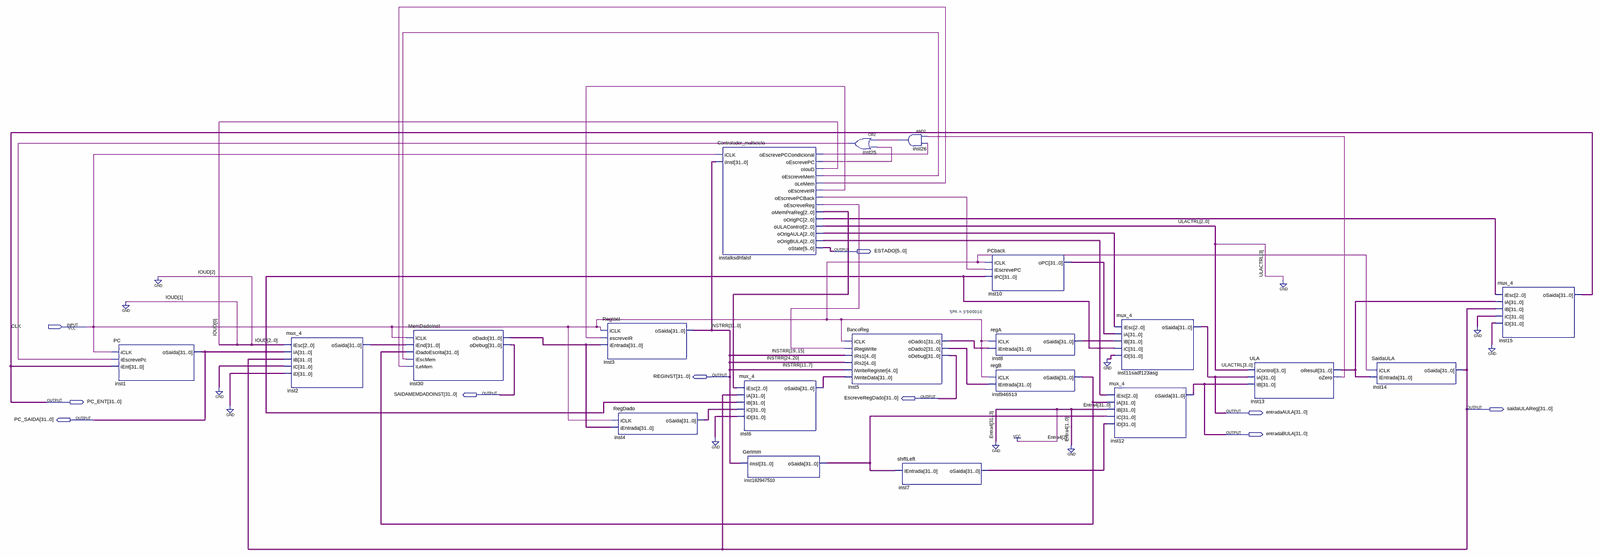
[diagram p0: schematic sheet, whole]
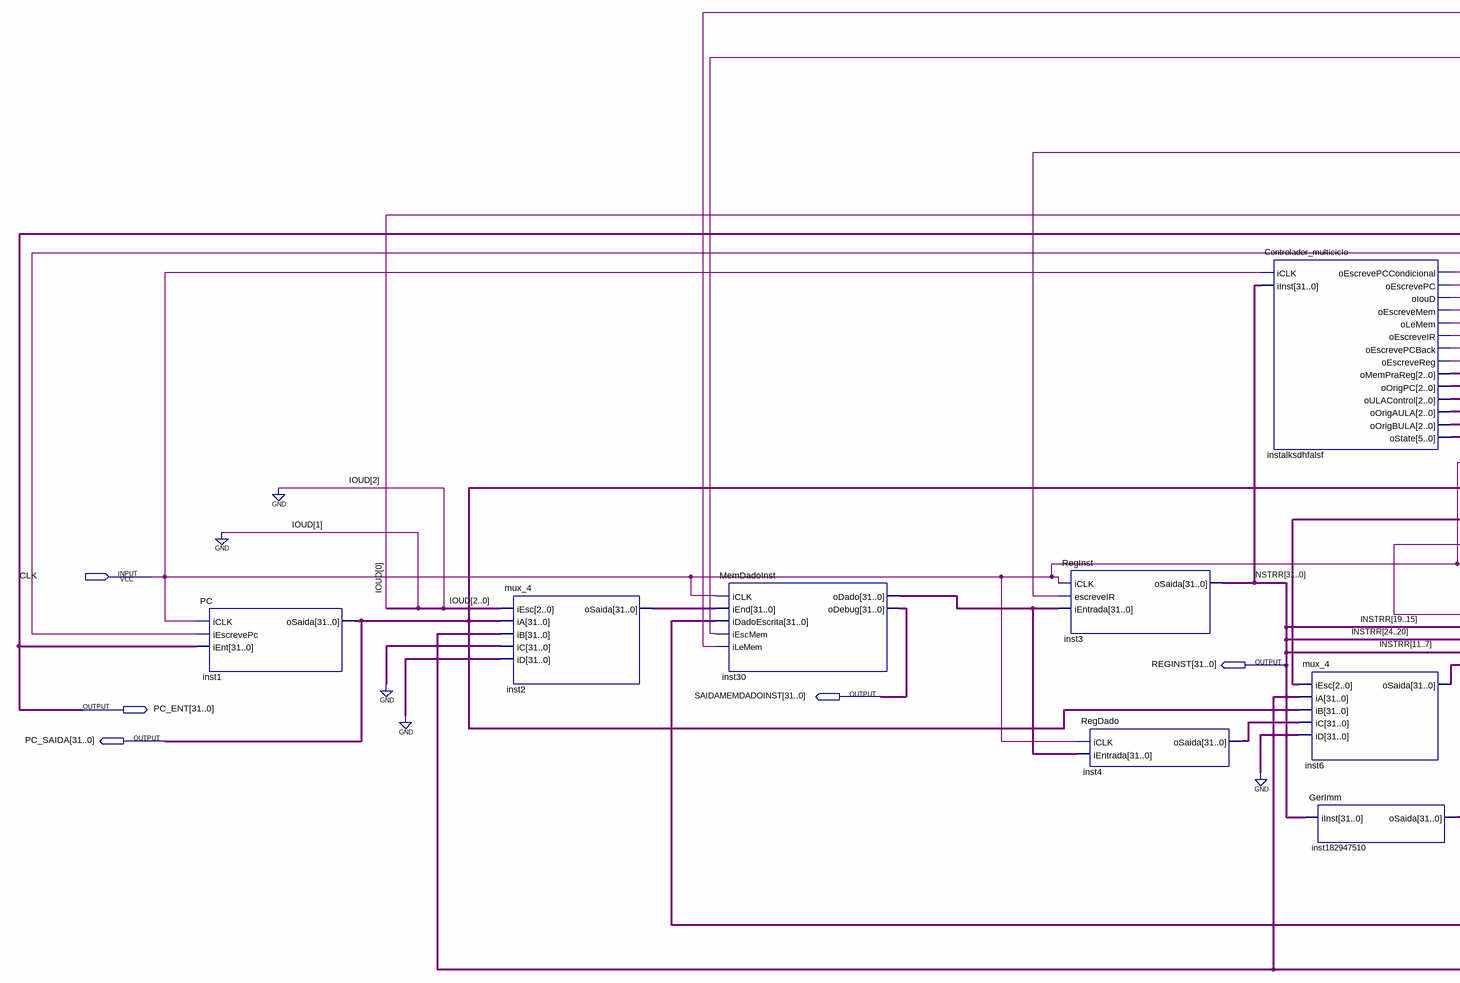
[diagram p1: schematic sheet, left part]
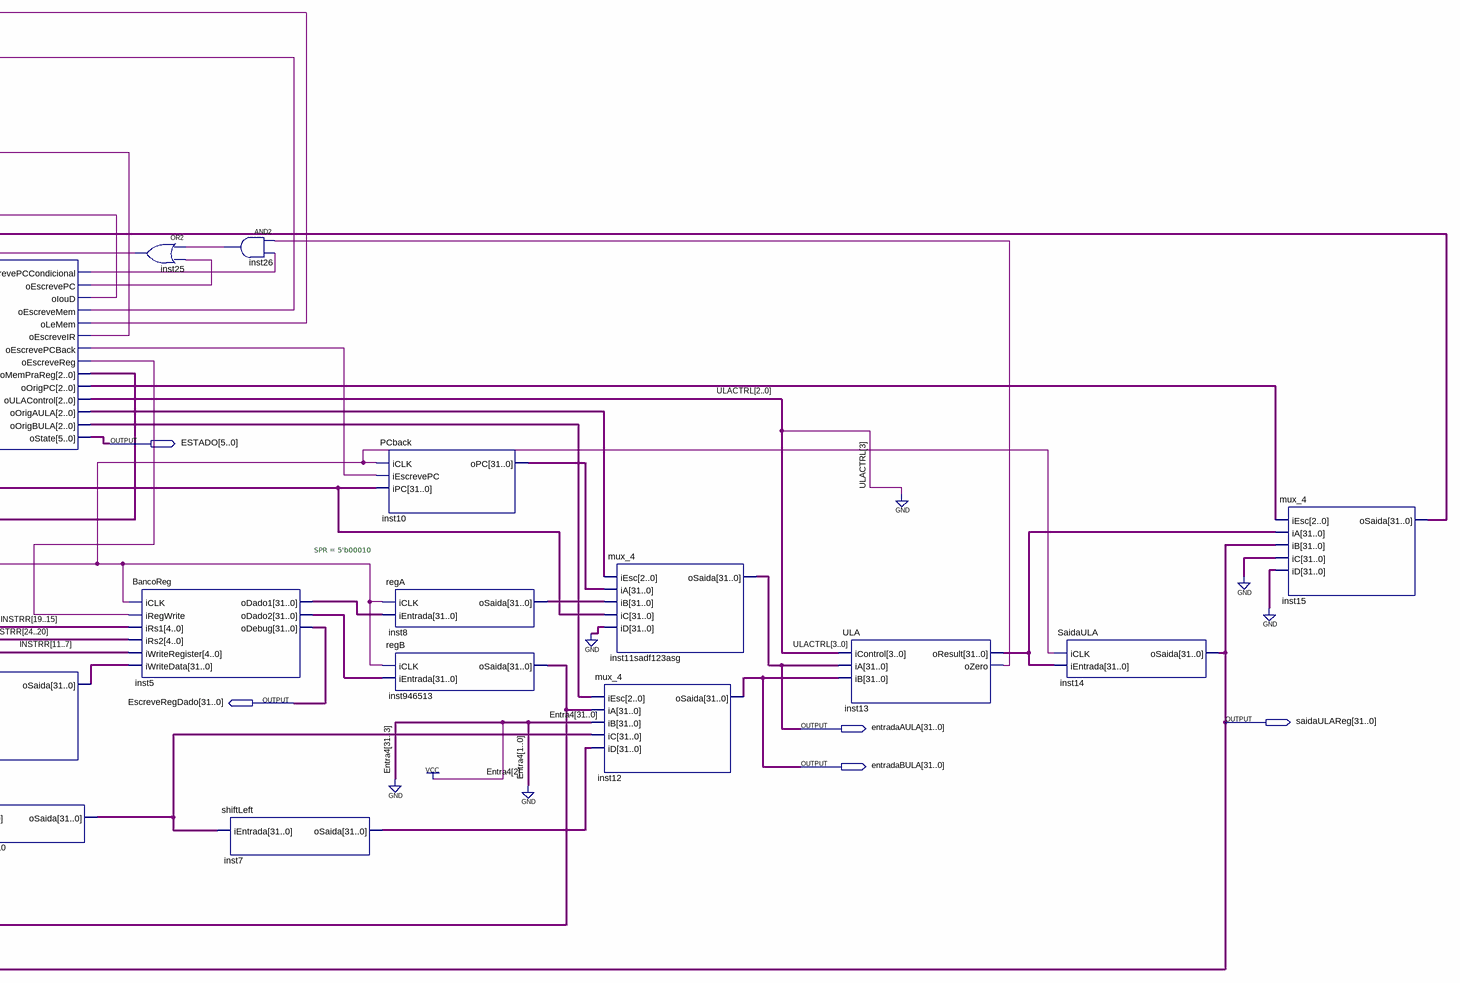
[diagram p2: schematic sheet, right part]
// Quartus schematic multiciclo.bdf as structural Verilog: 20 symbols, 10 pins
module multiciclo (
  input  CLK,
  output [5:0] ESTADO,
  output [31:0] REGINST,
  output [31:0] SAIDAMEMDADOINST,
  output [31:0] EscreveRegDado,
  output [31:0] PC_ENT,
  output [31:0] saidaULAReg,
  output [31:0] entradaAULA,
  output [31:0] PC_SAIDA,
  output [31:0] entradaBULA
);

  wire inst13_ozero, inst25_out, inst26_out, instalksdhfalsf_oescreveir, instalksdhfalsf_oescrevemem,
       instalksdhfalsf_oescrevepc, instalksdhfalsf_oescrevepcback, instalksdhfalsf_oescrevepccondicional,
       instalksdhfalsf_oescrevereg, instalksdhfalsf_olemem;
  wire [0:0] IOUD;
  wire [2:0] instalksdhfalsf_omemprareg, instalksdhfalsf_oorigaula, instalksdhfalsf_oorigbula,
       instalksdhfalsf_oorigpc, ULACTRL;
  wire [31:0] inst2_osaida, inst4_osaida, inst5_odado1, inst5_odado2, inst6_osaida, inst7_osaida,
       inst8_osaida, inst10_opc, inst13_oresult, inst30_odado, inst946513_osaida, inst182947510_osaida;

  PC inst1 (.iCLK(CLK), .iEscrevePc(inst25_out), .iEnt(PC_ENT), .oSaida(PC_SAIDA));
  mux_4 inst2 (
    .iEsc({2'b00, IOUD[0]}), .iA(PC_SAIDA), .iB(saidaULAReg), .iC({32{1'b0}}), .iD({32{1'b0}}),
    .oSaida(inst2_osaida));
  MemDadoInst inst30 (
    .iCLK(CLK), .iEnd(inst2_osaida), .iDadoEscrita(inst946513_osaida), .iEscMem(instalksdhfalsf_oescrevemem),
    .iLeMem(instalksdhfalsf_olemem), .oDado(inst30_odado), .oDebug(SAIDAMEMDADOINST));
  RegInst inst3 (.iCLK(CLK), .escreveIR(instalksdhfalsf_oescreveir), .iEntrada(inst30_odado), .oSaida(REGINST));
  RegDado inst4 (.iCLK(CLK), .iEntrada(inst30_odado), .oSaida(inst4_osaida));
  Controlador_multiciclo instalksdhfalsf (
    .iCLK(CLK), .iInst(REGINST), .oEscrevePCCondicional(instalksdhfalsf_oescrevepccondicional),
    .oEscrevePC(instalksdhfalsf_oescrevepc), .oIouD(IOUD[0]), .oEscreveMem(instalksdhfalsf_oescrevemem),
    .oLeMem(instalksdhfalsf_olemem), .oEscreveIR(instalksdhfalsf_oescreveir),
    .oEscrevePCBack(instalksdhfalsf_oescrevepcback), .oEscreveReg(instalksdhfalsf_oescrevereg),
    .oMemPraReg(instalksdhfalsf_omemprareg), .oOrigPC(instalksdhfalsf_oorigpc), .oULAControl(ULACTRL),
    .oOrigAULA(instalksdhfalsf_oorigaula), .oOrigBULA(instalksdhfalsf_oorigbula), .oState(ESTADO));
  mux_4 inst6 (
    .iEsc(instalksdhfalsf_omemprareg), .iA(saidaULAReg), .iB(PC_SAIDA), .iC(inst4_osaida), .iD({32{1'b0}}),
    .oSaida(inst6_osaida));
  GerImm inst182947510 (.iInst(REGINST), .oSaida(inst182947510_osaida));
  or inst25 (inst25_out, inst26_out, instalksdhfalsf_oescrevepc);
  BancoReg #(.SPR(5'b00010)) inst5 (
    .iCLK(CLK), .iRegWrite(instalksdhfalsf_oescrevereg), .iRs1(REGINST[19:15]), .iRs2(REGINST[24:20]),
    .iWriteRegister(REGINST[11:7]), .iWriteData(inst6_osaida), .oDado1(inst5_odado1), .oDado2(inst5_odado2),
    .oDebug(EscreveRegDado));
  and inst26 (inst26_out, inst13_ozero, instalksdhfalsf_oescrevepccondicional);
  shiftLeft inst7 (.iEntrada(inst182947510_osaida), .oSaida(inst7_osaida));
  PCback inst10 (.iCLK(CLK), .iEscrevePC(instalksdhfalsf_oescrevepcback), .iPC(PC_SAIDA), .oPC(inst10_opc));
  regA inst8 (.iCLK(CLK), .iEntrada(inst5_odado1), .oSaida(inst8_osaida));
  regB inst946513 (.iCLK(CLK), .iEntrada(inst5_odado2), .oSaida(inst946513_osaida));
  mux_4 inst11sadf123asg (
    .iEsc(instalksdhfalsf_oorigaula), .iA(inst10_opc), .iB(inst8_osaida), .iC(PC_SAIDA), .iD({32{1'b0}}),
    .oSaida(entradaAULA));
  mux_4 inst12 (
    .iEsc(instalksdhfalsf_oorigbula), .iA(inst946513_osaida), .iB(32'b00000000000000000000000000000100),
    .iC(inst182947510_osaida), .iD(inst7_osaida), .oSaida(entradaBULA));
  ULA inst13 (
    .iControl({1'b0, ULACTRL}), .iA(entradaAULA), .iB(entradaBULA), .oResult(inst13_oresult),
    .oZero(inst13_ozero));
  SaidaULA inst14 (.iCLK(CLK), .iEntrada(inst13_oresult), .oSaida(saidaULAReg));
  mux_4 inst15 (
    .iEsc(instalksdhfalsf_oorigpc), .iA(inst13_oresult), .iB(saidaULAReg), .iC({32{1'b0}}), .iD({32{1'b0}}),
    .oSaida(PC_ENT));

  // Other names for the same wires on the sheet: INSTRR[31:0] = REGINST
endmodule
